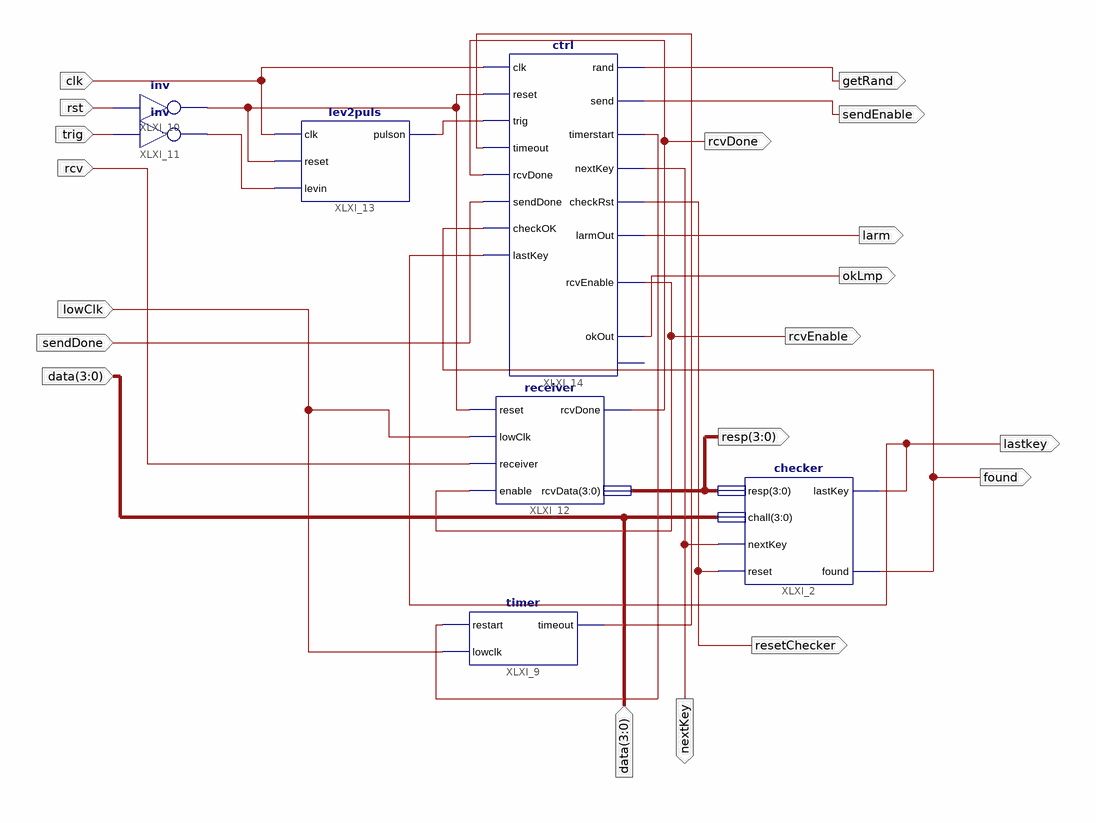
[diagram p0: schematic sheet 1]
// Xilinx ISE schematic top.sch (xc9500xl) as structural Verilog: 7 symbols, 18 ports
module top (
  input  sendDone,
  input  [3:0] data,
  input  clk,
  input  rst,
  input  trig,
  input  lowClk,
  input  rcv,
  output nextKey,
  output resetChecker,
  output lastkey,
  output getRand,
  output sendEnable,
  output larm,
  output [3:0] resp,
  output rcvDone,
  output rcvEnable,
  output okLmp,
  output found
);

  wire Timeout, XLXN_30, XLXN_106, XLXN_109, XLXN_110;

  not XLXI_10 (XLXN_109, rst);
  not XLXI_11 (XLXN_106, trig);
  \checker  XLXI_2 (
    .resp(resp), .chall(data), .nextKey(nextKey), .reset(resetChecker), .lastKey(lastkey), .found(found));
  timer XLXI_9 (.restart(XLXN_30), .lowclk(lowClk), .timeout(Timeout));
  receiver XLXI_12 (
    .reset(XLXN_109), .lowClk(lowClk), .receiver(rcv), .enable(rcvEnable), .rcvDone(rcvDone), .rcvData(resp));
  lev2puls XLXI_13 (.clk(clk), .reset(XLXN_109), .levin(XLXN_106), .pulson(XLXN_110));
  ctrl XLXI_14 (
    .clk(clk), .reset(XLXN_109), .trig(XLXN_110), .timeout(Timeout), .rcvDone(rcvDone), .sendDone(sendDone),
    .checkOK(found), .lastKey(lastkey), .\rand (getRand), .send(sendEnable), .rcvEnable(rcvEnable),
    .timerstart(XLXN_30), .nextKey(nextKey), .checkRst(resetChecker), .larmOut(larm), .okOut(okLmp));
endmodule
